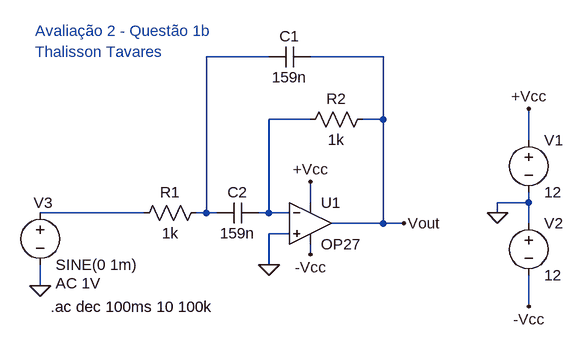
[diagram p0: schematic 2oEE 2020.2 Question 1b.asc]
2oEE 2020.2 Question 1b.asc, the LTspice schematic file:
Version 4
SHEET 1 1868 904
WIRE 368 16 272 16
WIRE 544 16 432 16
WIRE 432 112 368 112
WIRE 544 112 544 16
WIRE 544 112 512 112
WIRE 768 144 768 96
WIRE 432 240 432 208
WIRE 768 240 768 224
WIRE 768 240 720 240
WIRE 176 256 16 256
WIRE 272 256 272 16
WIRE 272 256 256 256
WIRE 288 256 272 256
WIRE 368 256 368 112
WIRE 368 256 352 256
WIRE 400 256 368 256
WIRE 720 256 720 240
WIRE 544 272 544 112
WIRE 544 272 464 272
WIRE 576 272 544 272
WIRE 768 272 768 240
WIRE 400 288 368 288
WIRE 432 320 432 304
WIRE 368 336 368 288
WIRE 16 368 16 336
WIRE 768 400 768 352
FLAG 720 256 0
FLAG 768 96 +Vcc
FLAG 768 400 -Vcc
FLAG 432 208 +Vcc
FLAG 432 320 -Vcc
FLAG 16 368 0
FLAG 576 272 Vout
FLAG 368 336 0
SYMBOL voltage 768 128 R0
WINDOW 123 0 0 Left 0
WINDOW 39 0 0 Left 0
SYMATTR InstName V1
SYMATTR Value 12
SYMBOL voltage 768 256 R0
WINDOW 123 0 0 Left 0
WINDOW 39 0 0 Left 0
SYMATTR InstName V2
SYMATTR Value 12
SYMBOL voltage 16 240 R0
WINDOW 123 24 124 Left 2
WINDOW 39 0 0 Left 0
WINDOW 0 -10 0 Left 2
SYMATTR Value2 AC 1V
SYMATTR InstName V3
SYMATTR Value SINE(0 1m)
SYMBOL OpAmps\\OP27 432 208 R0
SYMATTR InstName U1
SYMBOL cap 352 240 R90
WINDOW 0 0 32 VBottom 2
WINDOW 3 32 32 VTop 2
SYMATTR InstName C2
SYMATTR Value 159n
SYMBOL res 272 240 R90
WINDOW 0 0 56 VBottom 2
WINDOW 3 32 56 VTop 2
SYMATTR InstName R1
SYMATTR Value 1k
SYMBOL res 528 96 R90
WINDOW 0 0 56 VBottom 2
WINDOW 3 32 56 VTop 2
SYMATTR InstName R2
SYMATTR Value 1k
SYMBOL cap 432 0 R90
WINDOW 0 0 32 VBottom 2
WINDOW 3 32 32 VTop 2
SYMATTR InstName C1
SYMATTR Value 159n
TEXT 8 -24 Left 2 ;Avaliação 2 - Questão 1b
TEXT 8 8 Left 2 ;Thalisson Tavares
TEXT 32 400 Left 2 !.ac dec 100ms 10 100k

The netlist it stands for:
* 2oEE 2020.2 Question 1b.asc
V1 +Vcc 0 12
V2 0 -Vcc 12
V3 N003 0 SINE(0 1m) AC 1V
XU1 0 N002 +Vcc -Vcc Vout OP27  ; pins In+ In- V+ V- OUT
C2 N002 N001 159n
R1 N001 N003 1k
R2 Vout N002 1k
C1 Vout N001 159n
* Avaliação 2 - Questão 1b
* Thalisson Tavares
.ac dec 100ms 10 100k
.lib ADI.lib
.backanno
.end